# EAGLE design Pushbutton Breakout - Schematic (EAGLE 6.5.0)
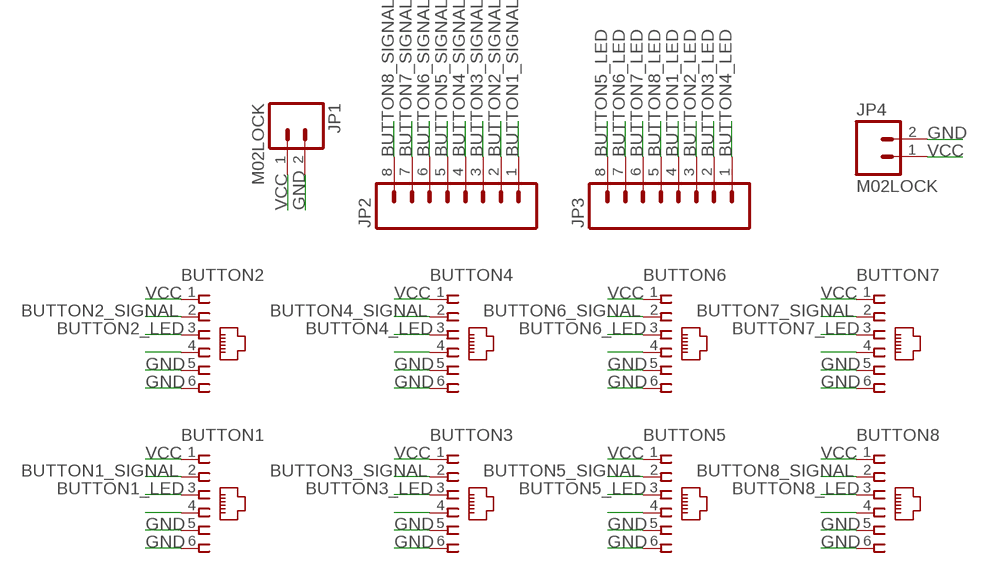
[diagram p0: schematic, sheet 1]

## Parts
BUTTON1  555165-1  [555165-1]
BUTTON2  555165-1  [555165-1]
BUTTON3  555165-1  [555165-1]
BUTTON4  555165-1  [555165-1]
BUTTON5  555165-1  [555165-1]
BUTTON6  555165-1  [555165-1]
BUTTON7  555165-1  [555165-1]
BUTTON8  555165-1  [555165-1]
JP1  M02LOCK  [1X02_LOCK]
JP2  M08LOCK  [1X08_LOCK]
JP3  M08LOCK  [1X08_LOCK]
JP4  M02LOCK  [1X02_LOCK]

## Nets
BUTTON1_LED: BUTTON1.3 JP3.4
BUTTON1_SIGNAL: BUTTON1.2 JP2.1
BUTTON2_LED: BUTTON2.3 JP3.3
BUTTON2_SIGNAL: BUTTON2.2 JP2.2
BUTTON3_LED: BUTTON3.3 JP3.2
BUTTON3_SIGNAL: BUTTON3.2 JP2.3
BUTTON4_LED: BUTTON4.3 JP3.1
BUTTON4_SIGNAL: BUTTON4.2 JP2.4
BUTTON5_LED: BUTTON5.3 JP3.8
BUTTON5_SIGNAL: BUTTON5.2 JP2.5
BUTTON6_LED: BUTTON6.3 JP3.7
BUTTON6_SIGNAL: BUTTON6.2 JP2.6
BUTTON7_LED: BUTTON7.3 JP3.6
BUTTON7_SIGNAL: BUTTON7.2 JP2.7
BUTTON8_LED: BUTTON8.3 JP3.5
BUTTON8_SIGNAL: BUTTON8.2 JP2.8
GND: BUTTON1.5 BUTTON1.6 BUTTON2.5 BUTTON2.6 BUTTON3.5 BUTTON3.6 BUTTON4.5 BUTTON4.6 BUTTON5.5 BUTTON5.6 BUTTON6.5 BUTTON6.6 BUTTON7.5 BUTTON7.6 BUTTON8.5 BUTTON8.6 JP1.2 JP4.2
N$1: BUTTON2.4
N$2: BUTTON3.4
N$3: BUTTON4.4
N$4: BUTTON1.4
N$5: BUTTON5.4
N$6: BUTTON6.4
N$7: BUTTON7.4
N$8: BUTTON8.4
VCC: BUTTON1.1 BUTTON2.1 BUTTON3.1 BUTTON4.1 BUTTON5.1 BUTTON6.1 BUTTON7.1 BUTTON8.1 JP1.1 JP4.1

## Library data of the parts
BUTTON1-BUTTON8 = con-amp:555165-1: AMP connector
JP1 JP4 = SparkFun-Connectors:M02: Standard 2-pin 0.1" header. Use with - straight break away headers ( PRT-00116) - right angle break away headers (PRT-00553) - swiss pins (PRT-00743) - machine pins (PRT-00117) - female headers (PRT-00115) Molex polarized connector foot print use with: PRT-08233 with associated crimp pins and housings. 2.54_SCREWTERM for use with PRT-10571. 3.5mm Screw Terminal footprints for PRT-08084 5mm Screw Terminal footprints for use with PRT-08433
JP2 JP3 = SparkFun-Connectors:M08: Header 8 Standard 8-pin 0.1" header. Use with straight break away headers (SKU : PRT-00116), right angle break away headers (PRT-00553), swiss pins (PRT-00743), machine pins (PRT-00117), and female headers (PRT-00115).

## Board
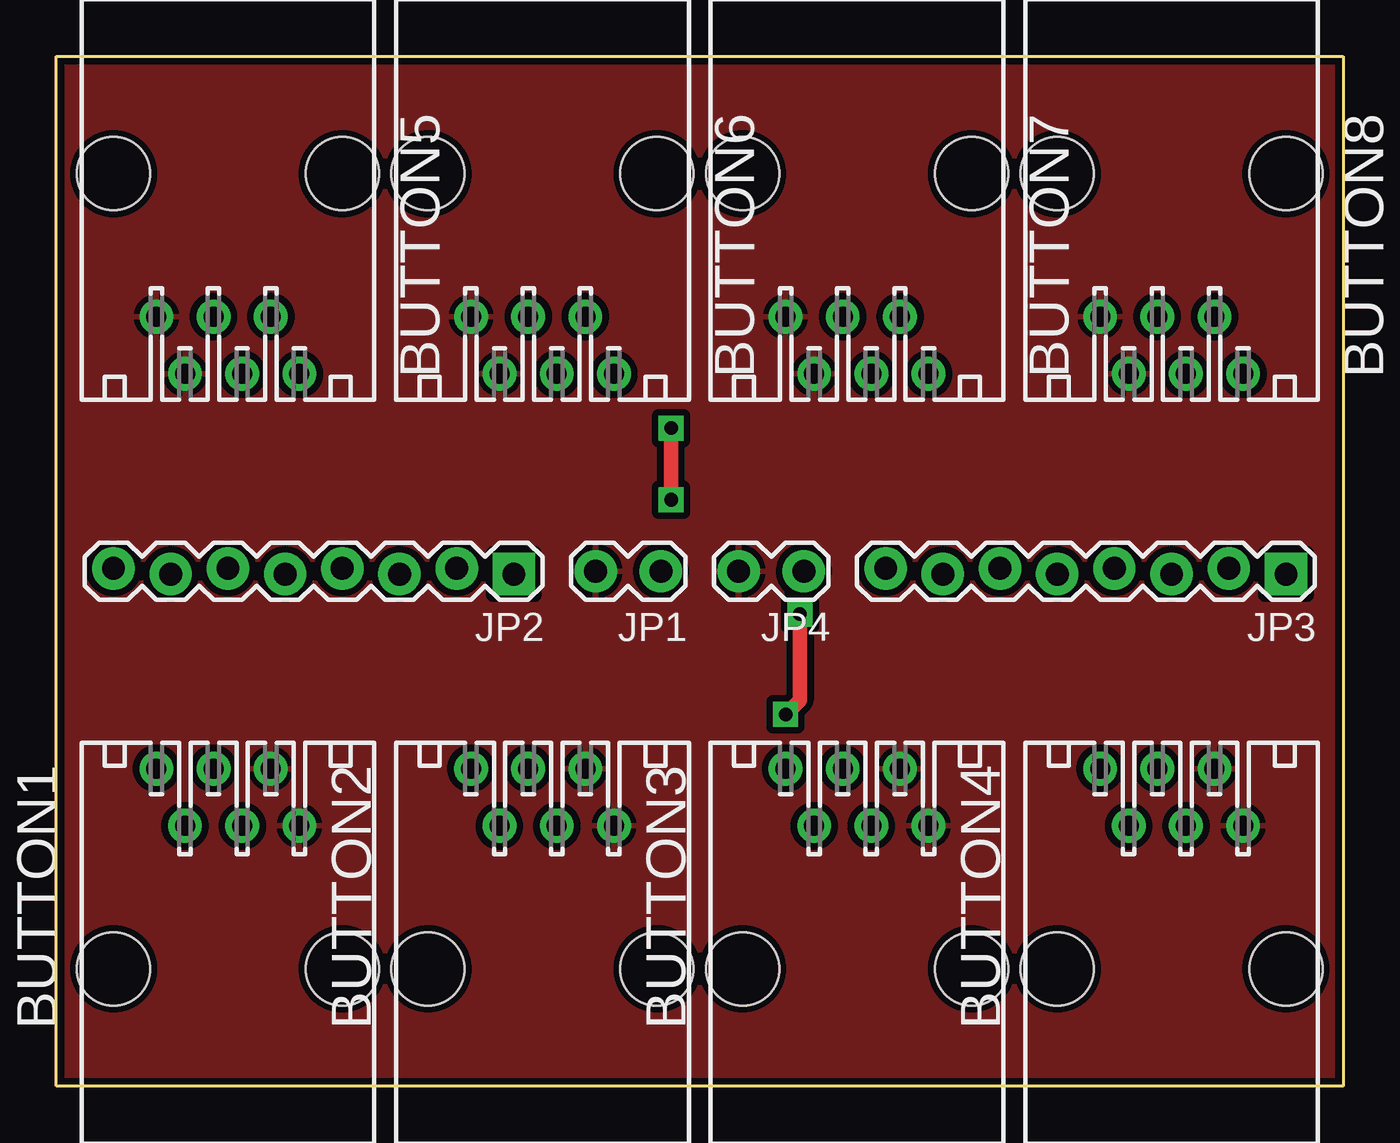
[diagram p1: board, top side]
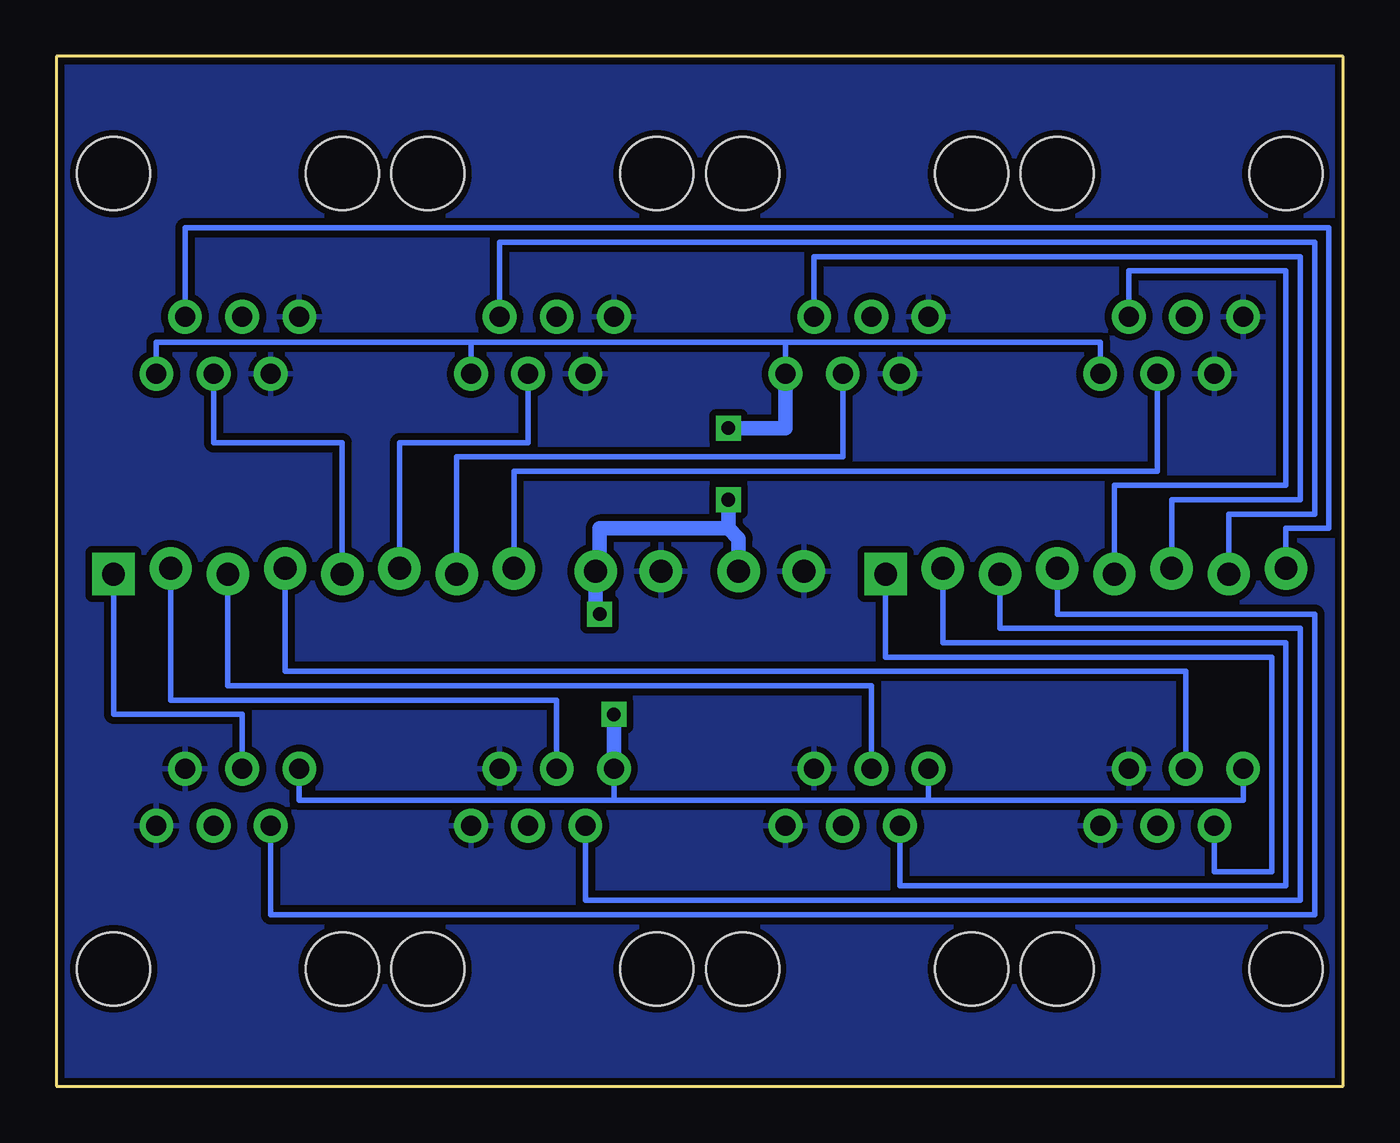
[diagram p2: board, bottom side, seen from below]

Size 57.15 x 45.72 mm. Coordinates in mm from the lower left corner, seen from the top.
Outline: 0,0 56.82,0
Outline: 56.82,45.71 0,45.71 0,0
Outline: 0,0 0,45.72 57.15,45.72 57.15,0 0,0
Copper layers (1*16): Top 0.035mm / dielectric 1.5mm / Bottom 0.035mm
Design rules "SparkFun": minimum track width 8mil, minimum drill 20mil, track to track 8mil, track to pad 8mil, pad to pad 8mil, via to via 8mil, smd to smd 8mil, copper to edge 8mil, drill to drill 8mil, minimum pad ring 12mil, minimum via ring 10mil, stop-mask expansion 4mil, vias tented up to drill 20mil, thermal gap 10mil

### Footprints (pad centres in the part's own frame; a part is rotated, then mirrored left to right if it is on the bottom)
555165-1 = drill 0.889: 1 -3.175,7.747; 2 -1.905,5.207; 3 -0.635,7.747; 4 0.635,5.207; 5 1.905,7.747; 6 3.175,5.207 | hole 3.251: -5.08,-1.143; 5.08,-1.143
1X02_LOCK = drill 1.016 pad 1.88: 1 -0.178,0; 2 2.718,0
1X08_LOCK = drill 1.016 pad 1.88 square: 1 0,0.127 | drill 1.016 pad 1.88: 2 2.54,-0.127; 3 5.08,0.127; 4 7.62,-0.127; 5 10.16,0.127; 6 12.7,-0.127; 7 15.24,0.127; 8 17.78,-0.127

### Placement (x,y rotation side)
BUTTON1  7.62,6.35 0 top
BUTTON2  21.59,6.35 0 top
BUTTON3  35.56,6.35 0 top
BUTTON4  49.53,6.35 0 top
BUTTON5  7.62,39.37 180 top
BUTTON6  21.59,39.37 180 top
BUTTON7  35.56,39.37 180 top
BUTTON8  49.53,39.37 180 top
JP1  26.67,22.86 180 top
JP2  20.32,22.86 180 top
JP3  54.61,22.86 180 top
JP4  33.02,22.86 180 top

### Tracks (layer width: path | path; a pad name or v marks a point on that pad's centre or on a via)
BUTTON1_LED
  Bottom 0.254: JP3.4 46.99,18.41 6.99,18.41 BUTTON1.3
BUTTON1_SIGNAL
  Bottom 0.254: JP2.1 20.32,19.05 3.17,19.05 3.17,9.53 5.71,9.53 BUTTON1.2
BUTTON2_LED
  Bottom 0.254: JP3.3 49.53,17.78 20.95,17.78 BUTTON2.3
BUTTON2_SIGNAL
  Bottom 0.254: JP2.2 17.78,19.68 2.54,19.68 2.54,8.89 19.68,8.89 BUTTON2.2
BUTTON3_LED
  Bottom 0.254: JP3.2 52.07,17.14 34.92,17.14 BUTTON3.3
BUTTON3_SIGNAL
  Bottom 0.254: JP2.3 15.24,20.32 1.91,20.32 1.91,8.26 33.66,8.26 BUTTON3.2
BUTTON4_LED
  Bottom 0.254: JP3.1 54.61,16.51 48.9,16.51 BUTTON4.3
BUTTON4_SIGNAL
  Bottom 0.254: JP2.4 12.7,20.95 1.27,20.95 1.27,7.62 47.62,7.62 BUTTON4.2
BUTTON5_LED
  Bottom 0.254: JP3.8 36.83,27.3 8.26,27.3 BUTTON5.3
BUTTON5_SIGNAL
  Bottom 0.254: JP2.5 10.16,26.67 2.54,26.67 2.54,36.2 9.53,36.2 BUTTON5.2
BUTTON6_LED
  Bottom 0.254: JP3.7 39.37,27.94 22.23,27.94 BUTTON6.3
BUTTON6_SIGNAL
  Bottom 0.254: JP2.6 7.62,26.04 1.91,26.04 1.91,36.83 23.5,36.83 BUTTON6.2
BUTTON7_LED
  Bottom 0.254: JP3.6 41.91,28.57 36.2,28.57 BUTTON7.3
BUTTON7_SIGNAL
  Bottom 0.254: JP2.7 5.08,25.4 1.27,25.4 1.27,37.47 37.47,37.47 BUTTON7.2
BUTTON8_LED
  Bottom 0.254: JP3.5 44.45,28.57 50.16,28.57 BUTTON8.3
BUTTON8_SIGNAL
  Bottom 0.254: JP2.8 2.54,24.77 0.64,24.77 0.64,38.1 51.44,38.1 BUTTON8.2
GND
  pour Bottom (isolate 0.305): 0,0 0,45.72 57.15,45.72 57.15,0
  pour Top (isolate 0.305): 0,0 0,45.72 57.15,45.72 57.15,0
VCC  (via drill 0.6)
  Top 0.635: v33.02,20.95 33.02,17.14 v32.38,16.51 | v27.3,26.04 v27.3,29.21
  Bottom 0.254: BUTTON5.1 10.79,33.02 24.77,33.02 | BUTTON6.1 24.77,33.02 | 24.77,33.02 38.73,33.02 | BUTTON7.1 38.73,33.02 | 38.73,33.02 52.7,33.02 BUTTON8.1 | BUTTON1.1 4.45,12.7 18.41,12.7 | BUTTON2.1 18.41,12.7 | 18.41,12.7 32.38,12.7 | BUTTON3.1 32.38,12.7 | 32.38,12.7 46.35,12.7 BUTTON4.1
  Bottom 0.635: v33.02,20.95 33.2,21.13 JP4.1 33.02,23.04 33.02,24.77 27.3,24.77 | v32.38,16.51 BUTTON3.1 | JP1.1 26.85,24.31 27.3,24.77 | 27.3,24.77 v27.3,26.04 | v27.3,29.21 24.77,29.21 BUTTON6.1